# EAGLE design blt_20221101 (EAGLE 9.6.2)
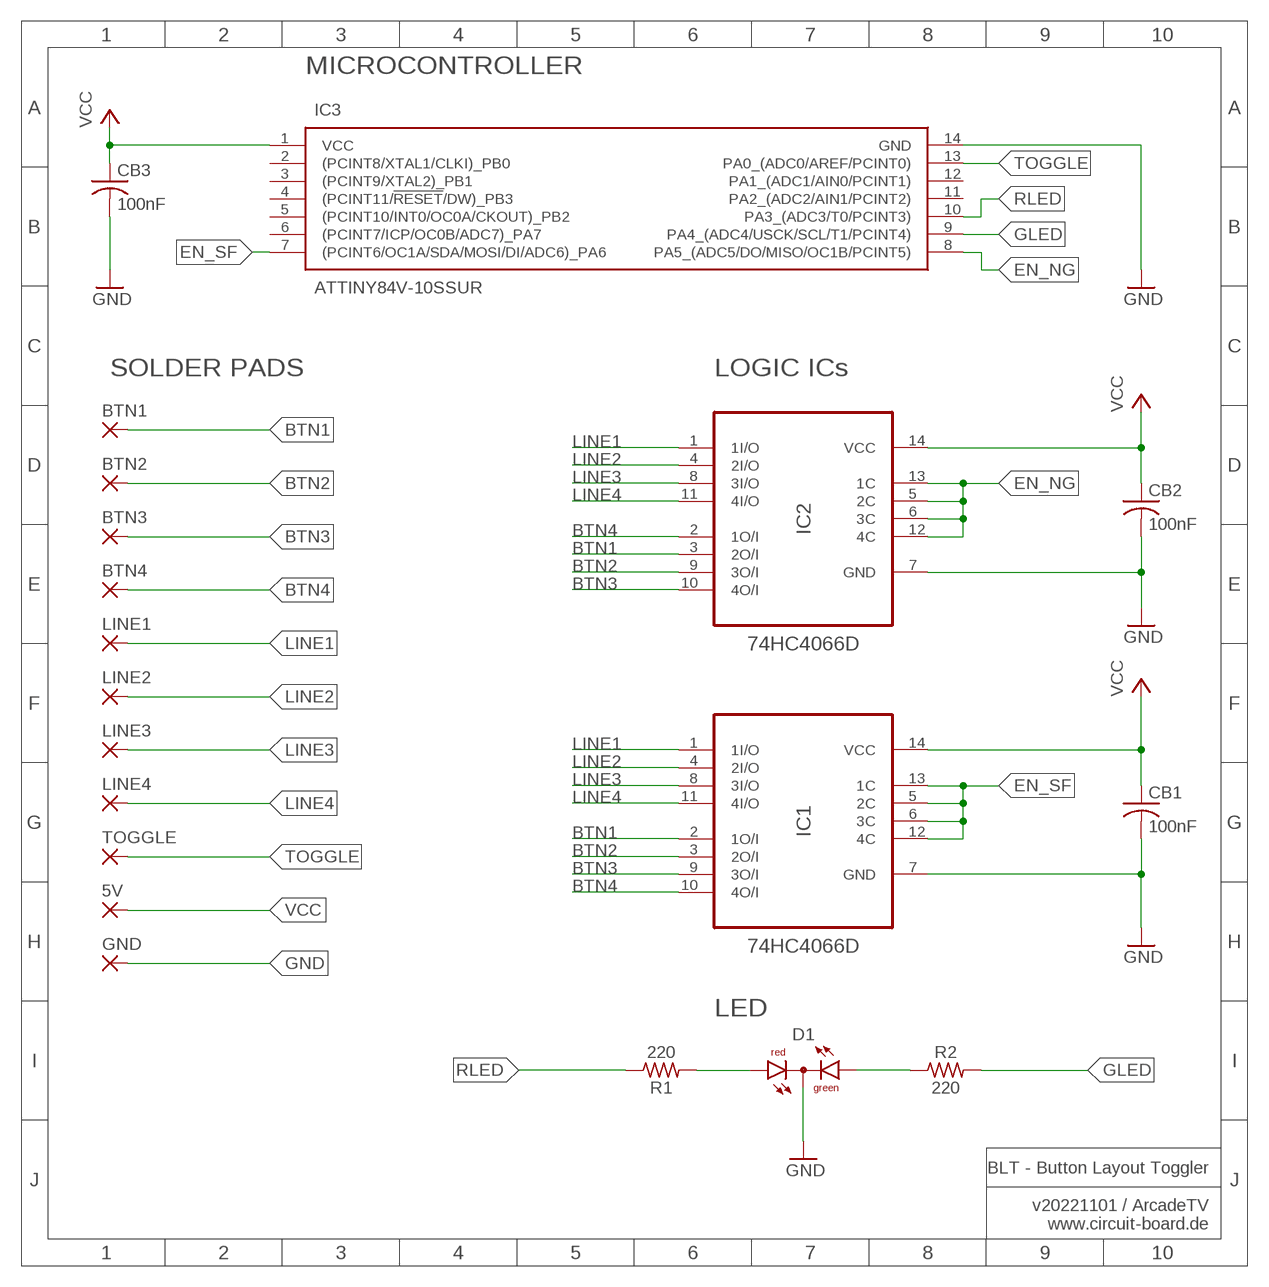
[diagram p0: schematic, sheet 1]

## Parts
5V  WIREPADSMD2,54-5,08  [SMD2,54-5,08]
BTN1  WIREPADSMD2,54-5,08  [SMD2,54-5,08]
BTN2  WIREPADSMD2,54-5,08  [SMD2,54-5,08]
BTN3  WIREPADSMD2,54-5,08  [SMD2,54-5,08]
BTN4  WIREPADSMD2,54-5,08  [SMD2,54-5,08]
CB1  100nF  C-USC0805  [C0805]
CB2  100nF  C-USC0805  [C0805]
CB3  100nF  C-USC0805  [C0805]
D1  DUOLED2X5  [DUOLED2X5]
GND  WIREPADSMD2,54-5,08  [SMD2,54-5,08]
IC1  74HC4066D  [SOIC127P600X175-14N]
IC2  74HC4066D  [SOIC127P600X175-14N]
IC3  ATTINY84V-10SSUR  [SOIC127P600X175-14N]
LINE1  WIREPADSMD2,54-5,08  [SMD2,54-5,08]
LINE2  WIREPADSMD2,54-5,08  [SMD2,54-5,08]
LINE3  WIREPADSMD2,54-5,08  [SMD2,54-5,08]
LINE4  WIREPADSMD2,54-5,08  [SMD2,54-5,08]
R1  220  R-US_R0805  [R0805]
R2  220  R-US_R0805  [R0805]
TOGGLE  WIREPADSMD2,54-5,08  [SMD2,54-5,08]

## Nets
BTN1: BTN1.1(P) IC1.2(1O/I) IC2.3(2O/I)
BTN2: BTN2.1(P) IC1.3(2O/I) IC2.9(3O/I)
BTN3: BTN3.1(P) IC1.9(3O/I) IC2.10(4O/I)
BTN4: BTN4.1(P) IC1.10(4O/I) IC2.2(1O/I)
EN_NG: IC2.5(2C) IC2.6(3C) IC2.12(4C) IC2.13(1C) IC3.8(PA5_(ADC5/DO/MISO/OC1B/PCINT5))
EN_SF: IC1.5(2C) IC1.6(3C) IC1.12(4C) IC1.13(1C) IC3.7((PCINT6/OC1A/SDA/MOSI/DI/ADC6)_PA6)
GLED: IC3.9(PA4_(ADC4/USCK/SCL/T1/PCINT4)) R2.2
GND: CB1.2 CB2.2 CB3.2 D1.K(C) GND.1(P) IC1.7(GND) IC2.7(GND) IC3.14(GND)
LINE1: IC1.1(1I/O) IC2.1(1I/O) LINE1.1(P)
LINE2: IC1.4(2I/O) IC2.4(2I/O) LINE2.1(P)
LINE3: IC1.8(3I/O) IC2.8(3I/O) LINE3.1(P)
LINE4: IC1.11(4I/O) IC2.11(4I/O) LINE4.1(P)
N$1: D1.AR R1.2
N$2: D1.AG R2.1
RLED: IC3.10(PA3_(ADC3/T0/PCINT3)) R1.1
TOGGLE: IC3.13(PA0_(ADC0/AREF/PCINT0)) TOGGLE.1(P)
VCC: 5V.1(P) CB1.1 CB2.1 CB3.1 IC1.14(VCC) IC2.14(VCC) IC3.1(VCC)
Unconnected: IC3.2((PCINT8/XTAL1/CLKI)_PB0) IC3.3((PCINT9/XTAL2)_PB1) IC3.4((PCINT11/!RESET!/DW)_PB3) IC3.5((PCINT10/INT0/OC0A/CKOUT)_PB2) IC3.6((PCINT7/ICP/OC0B/ADC7)_PA7) IC3.11(PA2_(ADC2/AIN1/PCINT2)) IC3.12(PA1_(ADC1/AIN0/PCINT1))

## Notes on the sheet
- MICROCONTROLLER
- SOLDER PADS | LOGIC ICs
- LED
- BLT - Button Layout Toggler
  
  v20221101 / ArcadeTV
  www.circuit-board.de

## Library data of the parts
5V BTN1-BTN4 GND LINE1-LINE4 TOGGLE = wirepad:WIREPAD: Wire PAD connect wire on PCB
CB1-CB3 = rcl:C-US: CAPACITOR, American symbol; SPICEPREFIX: C
D1 = led:DUOLED2X5: DUO LED 2 colors, 2.5 x 5 mm, recangle
IC1 IC2 = 74HC4066D:74HC4066D: Encoders, Decoders, Multiplexers & Demultiplexers CMOS Logic IC 500mW 2.0-6.0V Source: Datasheet <http://toshiba.semicon-storage.com/info/docget.jsp?did=55443&prodName=74HC4066D>
IC3 = ATTINY84V-10SSUR:ATTINY84V-10SSUR: MCU 8-bit AVR RISC 8KB Flash 2.5V/3.3V/5V 14-Pin SOIC W T/R Source: Datasheet <http://www.microchip.com/mymicrochip/filehandler.aspx?ddocname=en590735>; DESCRIPTION: MCU 8-bit AVR RISC 8KB Flash 2.5V/3.3V/5V 14-Pin SOIC W T/R; HEIGHT: 1.75mm; MANUFACTURER_NAME: Microchip; MANUFACTURER_PART_NUMBER: ATTINY84V-10SSUR; MOUSER_PART_NUMBER: 556-ATTINY84V-10SSUR; MOUSER_PRICE-STOCK: https://www.mouser.co.uk/ProductDetail/Microchip-Technology-Atmel/ATTINY84V-10SSUR?qs=6Dg1WZIWLC7huvQLwg3cTw%3D%3D
R1 R2 = rcl:R-US_: RESISTOR, American symbol; SPICEPREFIX: R

## Board
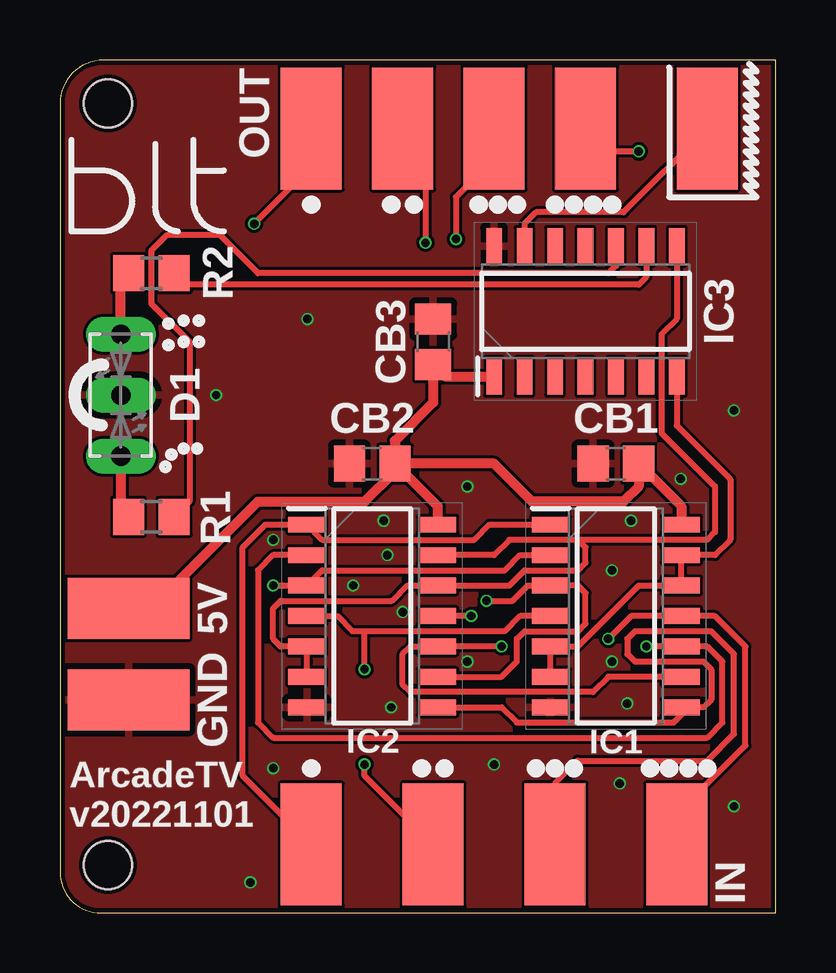
[diagram p1: board, top side]
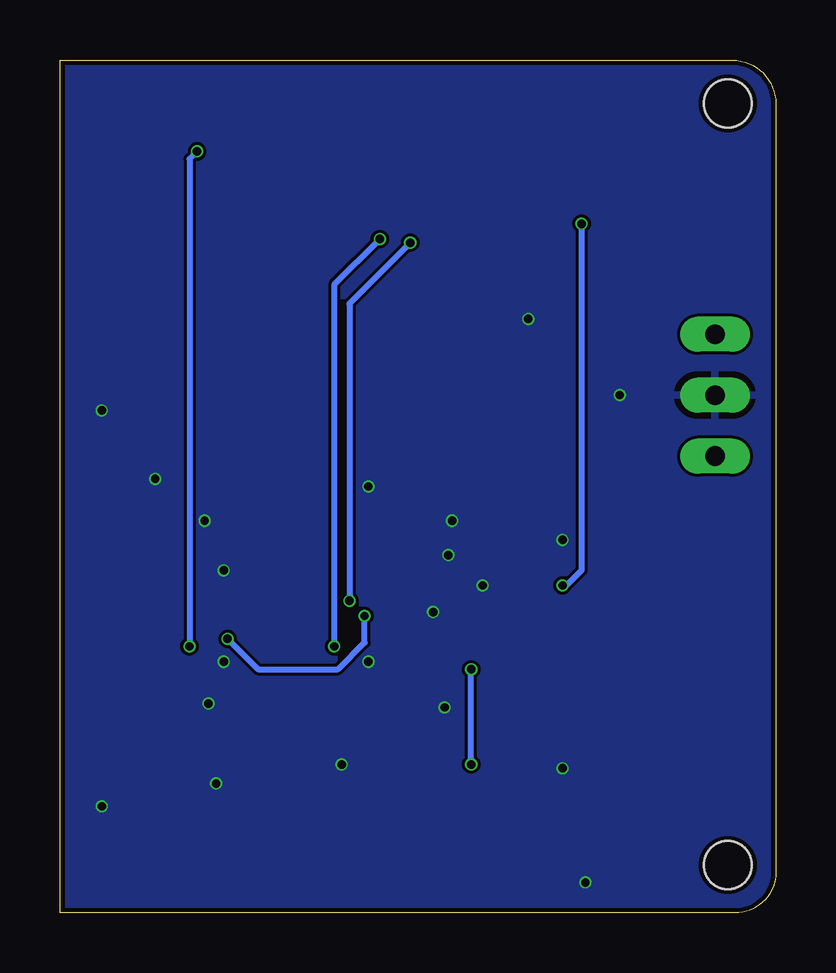
[diagram p2: board, bottom side, seen from below]

Size 29.84 x 35.56 mm. Coordinates in mm from the lower left corner, seen from the top.
Outline: 29.84,35.56 1.81,35.55 arc90 0,33.74 0,1.71 arc90 1.71,0 29.84,0 29.84,35.56
Copper layers (1*16): Top 0.035mm / dielectric 1.6mm / Bottom 0.035mm
Design rules "jlcpcb-2layers": minimum track width 5mil, minimum drill 0.3mm, track to track 5mil, track to pad 5mil, pad to pad 5mil, via to via 5mil, smd to smd 5mil, copper to edge 0.2mm, drill to drill 6mil, minimum pad ring 10mil, minimum via ring 3mil, stop-mask expansion 4mil, vias tented up to drill 0mil, thermal gap 10mil
Holes 2 mm at 2,2 2,33.75

### Footprints (pad centres in the part's own frame; a part is rotated, then mirrored left to right if it is on the bottom)
SMD2,54-5,08 = smd 2.54 x 5.08: 1 0,0
C0805 = smd 1.3 x 1.5: 1 -0.95,0; 2 0.95,0
DUOLED2X5 = drill 0.813 long: AG -2.54,0; AR 2.54,0; K 0,0
SOIC127P600X175-14N = smd 1.55 x 0.65: 1 -2.725,3.81; 2 -2.725,2.54; 3 -2.725,1.27; 4 -2.725,0; 5 -2.725,-1.27; 6 -2.725,-2.54; 7 -2.725,-3.81; 8 2.725,-3.81; 9 2.725,-2.54; 10 2.725,-1.27; 11 2.725,0; 12 2.725,1.27; 13 2.725,2.54; 14 2.725,3.81
SOIC127P600X175-14N' = smd 1.528 x 0.65: 1 -2.711,3.81; 2 -2.711,2.54; 3 -2.711,1.27; 4 -2.711,0; 5 -2.711,-1.27; 6 -2.711,-2.54; 7 -2.711,-3.81; 8 2.711,-3.81; 9 2.711,-2.54; 10 2.711,-1.27; 11 2.711,0; 12 2.711,1.27; 13 2.711,2.54; 14 2.711,3.81
R0805 = smd 1.3 x 1.5: 1 -0.95,0; 2 0.95,0

### Placement (x,y rotation side)
5V  2.86,12.7 90 top
BTN1  10.48,32.7 180 top
BTN2  14.29,32.7 180 top
BTN3  18.1,32.7 180 top
BTN4  21.91,32.7 0 top
CB1  23.18,18.73 180 top
CB2  13.02,18.73 180 top
CB3  15.56,23.81 90 top
D1  2.54,21.59 270 top
GND  2.86,8.89 90 top
IC1  23.18,12.38 0 top
IC2  13.02,12.38 0 top
IC3  ATTINY84V-10SSUR  [SOIC127P600X175-14N']  21.91,25.08 90 top
LINE1  10.48,2.86 0 top
LINE2  15.56,2.86 0 top
LINE3  20.64,2.86 0 top
LINE4  25.72,2.86 0 top
R1  3.81,16.51 180 top
R2  3.81,26.67 0 top
TOGGLE  26.99,32.7 180 top

### Tracks (layer width: path | path; a pad name or v marks a point on that pad's centre or on a via)
BTN1  (via drill 0.35)
  Top 0.254: IC1.2 19.18,14.92 18.55,14.29 10.93,14.29 IC2.3 v8.89,13.65 | BTN1.1 10.48,31.11 v8.1,28.73
  Bottom 0.254: v8.1,28.73 8.1,14.29 8.73,13.65 v8.89,13.65
BTN2  (via drill 0.35)
  Top 0.254: IC2.9 18.41,9.84 19.05,10.48 19.05,11.43 19.37,11.75 21.59,11.75 21.91,12.06 21.91,13.34 21.59,13.65 IC1.3 19.5,13.65 18.86,13.02 v17.78,13.02 | BTN2.1 15.24,31.75 v15.24,27.94
  Bottom 0.254: v15.24,27.94 17.78,25.4 v17.78,13.02
BTN3  (via drill 0.35)
  Top 0.254: IC1.9 22.86,9.84 22.23,9.21 14.61,9.21 14.29,9.53 14.29,10.79 14.61,11.11 IC2.10 v18.41,11.11 | BTN3.1 18.1,31.43 16.51,29.84 v16.51,28.1
  Bottom 0.254: v16.51,28.1 18.41,26.19 v18.41,11.11
BTN4  (via drill 0.35)
  Top 0.254: IC2.2 8.89,14.92 8.26,14.29 8.26,7.94 8.89,7.3 26.99,7.3 27.62,7.94 27.62,10.48 26.99,11.11 IC1.10 v24.45,11.11 | BTN4.1 22.86,31.75 v24.13,31.75
  Bottom 0.254: v24.13,31.75 24.45,31.43 v24.45,11.11
EN_NG
  Top 0.254: IC2.6 IC2.5 9.21,11.11 8.89,11.43 8.89,12.7 9.21,13.02 13.84,13.02 14.47,13.65 IC2.12 18.73,13.65 19.37,14.29 21.59,14.29 21.91,14.61 21.91,15.24 21.59,15.56 | 21.59,15.56 18.73,15.56 18.1,14.92 IC2.13 | 21.59,15.56 26.99,15.56 27.3,15.88 27.3,17.78 25.08,20 25.08,24.13 25.72,24.77 IC3.8
EN_SF
  Top 0.254: IC1.6 IC1.5 21.59,11.11 24.13,13.65 IC1.12 IC1.13 27.3,14.92 27.94,15.56 27.94,18.1 25.72,20.32 IC3.7
GLED
  Top 0.254: IC3.9 24.45,26.51 24.13,26.19 5.24,26.19 R2.2
GND  (via drill 0.35)
  other vias: 13.81,8.57 8.89,6.03 7.94,1.27 23.65,8.73 23.02,14.29 13.49,16.35 16.99,17.78 23.81,16.35 14.29,12.54 12.22,13.65 13.65,14.92 8.89,15.56 25.88,18.1 23.02,10.48 16.99,10.48 23.34,5.4 28.1,4.45 18.1,6.19 28.1,20.95 10.32,24.77 6.51,21.59
  pour Top: 0,0 0,35.56 29.84,35.56 29.84,0
  pour Bottom: 0,0 0,35.56 29.84,35.56 29.84,0
LINE1
  Top 0.254: IC1.1 17.91,16.19 17.28,15.56 10.93,15.56 IC2.1 8.57,16.19 7.62,15.24 7.62,5.71 LINE1.1
LINE2  (via drill 0.35)
  Top 0.254: 12.7,11.75 18.55,11.75 19.18,12.38 IC1.4 | 12.7,11.75 12.2,11.75 11.56,12.38 IC2.4 | LINE2.1 12.7,5.71 v12.7,6.19 | v12.7,10.16 12.7,11.75
  Bottom 0.254: v12.7,6.19 v12.7,10.16
LINE3
  Top 0.254: IC2.8 18.41,8.57 19.05,7.94 25.59,7.94 25.9,8.26 IC1.8 26.83,8.57 27.15,8.89 27.15,10.16 26.83,10.48 23.97,10.48 23.65,10.79 23.65,11.43 23.97,11.75 27.15,11.75 28.1,10.79 28.1,7.46 26.99,6.35 21.59,6.35 20.64,5.4 LINE3.1
LINE4  (via drill 0.35)
  Top 0.254: LINE4.1 25.72,4.13 28.57,6.99 28.57,11.11 27.3,12.38 IC1.11 23.81,12.38 v22.86,11.43 | v17.14,12.38 IC2.11
  Bottom 0.254: v22.86,11.43 21.59,10.16 18.26,10.16 17.14,11.27 v17.14,12.38
N$1
  Top 0.406: D1.AR 2.54,16.83 R1.2
N$2
  Top 0.406: D1.AG 2.54,26.35 R2.1
RLED
  Top 0.254: IC3.10 23.18,26.99 22.86,26.67 8.26,26.67 6.67,28.26 4.45,28.26 3.81,27.62 3.81,25.4 5.4,23.81 5.4,17.15 R1.1
TOGGLE
  Top 0.254: TOGGLE.1 23.5,29.21 19.84,29.21 19.37,28.73 IC3.13
VCC
  Top 0.406: IC1.14 25.9,16.96 CB1.1 24.13,17.78 23.5,17.14 19.68,17.14 18.1,18.73 14.29,18.73 14.13,18.57 | CB2.1 14.13,18.57 | 14.13,18.57 15.74,16.96 IC2.14 | IC3.1 16.05,22.37 CB3.1 15.56,21.27 13.97,19.68 CB2.1 | CB2.1 13.97,18.41 12.7,17.14 8.26,17.14 3.81,12.7 5V.1

### Text on the board
tPlace: OUT | 5V | GND | ArcadeTV / v20221101 | IN